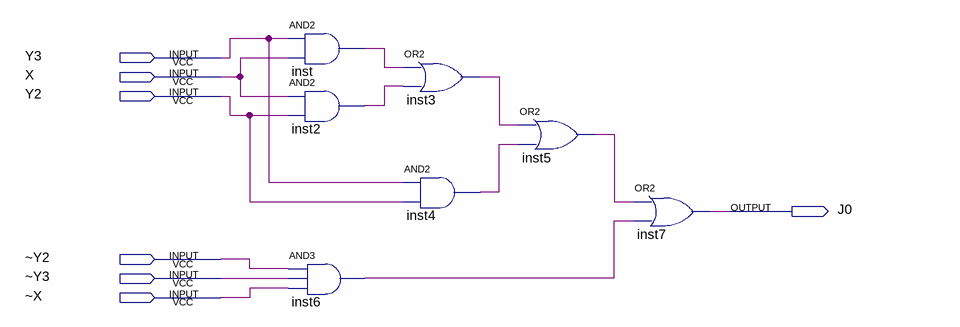
[diagram p0: schematic sheet]
// Quartus schematic J0.bdf as structural Verilog: 7 symbols, 7 pins
module J0 (
  input  Y3,
  input  X,
  input  Y2,
  input  \~Y2 ,
  input  \~Y3 ,
  input  \~X ,
  output J0
);

  wire inst2_out, inst3_out, inst4_out, inst5_out, inst6_out, inst_out;

  and inst (inst_out, Y3, X);
  and inst2 (inst2_out, X, Y2);
  and inst6 (inst6_out, \~Y2 , \~Y3 , \~X );
  or inst3 (inst3_out, inst_out, inst2_out);
  and inst4 (inst4_out, Y3, Y2);
  or inst5 (inst5_out, inst3_out, inst4_out);
  or inst7 (J0, inst5_out, inst6_out);
endmodule
